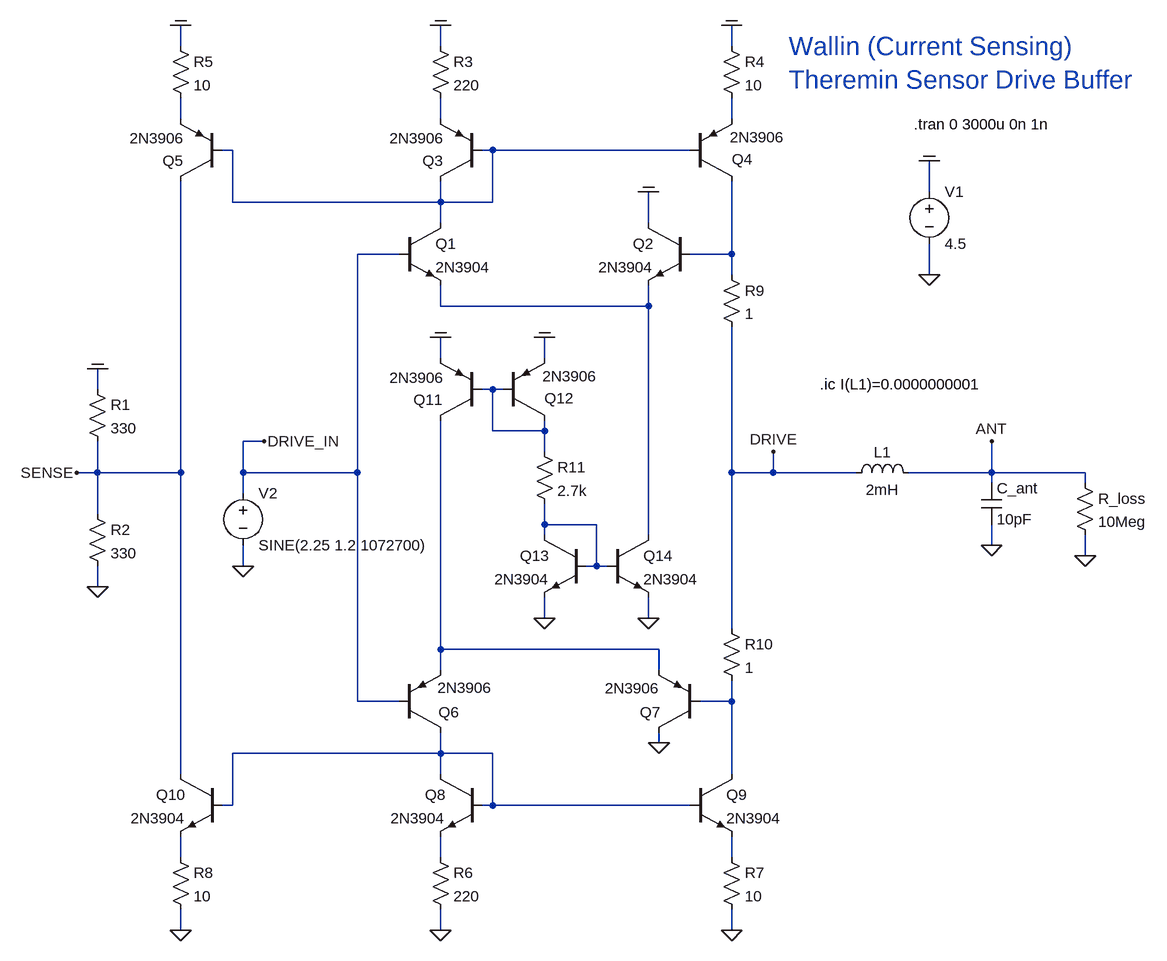
[diagram p0: schematic current_sensing_drive_buffer_v02.asc]
current_sensing_drive_buffer_v02.asc, the LTspice schematic file:
Version 4
SHEET 1 4504 6144
WIRE 864 2288 864 2256
WIRE 1264 2288 1264 2256
WIRE 1712 2288 1712 2256
WIRE 864 2400 864 2368
WIRE 1264 2400 1264 2368
WIRE 1712 2400 1712 2368
WIRE 944 2448 928 2448
WIRE 1344 2448 1328 2448
WIRE 1648 2448 1344 2448
WIRE 2016 2512 2016 2464
WIRE 944 2528 944 2448
WIRE 1264 2528 1264 2496
WIRE 1264 2528 944 2528
WIRE 1344 2528 1344 2448
WIRE 1344 2528 1264 2528
WIRE 1264 2560 1264 2528
WIRE 1584 2560 1584 2512
WIRE 1200 2608 1136 2608
WIRE 1712 2608 1712 2496
WIRE 1712 2608 1648 2608
WIRE 1712 2640 1712 2608
WIRE 2016 2640 2016 2592
WIRE 1264 2688 1264 2656
WIRE 1584 2688 1584 2656
WIRE 1584 2688 1264 2688
WIRE 1264 2768 1264 2736
WIRE 1424 2768 1424 2736
WIRE 736 2816 736 2784
WIRE 1344 2816 1328 2816
WIRE 1360 2816 1344 2816
WIRE 1344 2880 1344 2816
WIRE 1424 2880 1424 2864
WIRE 1424 2880 1344 2880
WIRE 992 2896 960 2896
WIRE 1424 2912 1424 2880
WIRE 736 2944 736 2896
WIRE 736 2944 704 2944
WIRE 864 2944 864 2496
WIRE 864 2944 736 2944
WIRE 960 2944 960 2896
WIRE 1136 2944 1136 2608
WIRE 1136 2944 960 2944
WIRE 1712 2944 1712 2720
WIRE 1776 2944 1776 2912
WIRE 1776 2944 1712 2944
WIRE 1904 2944 1776 2944
WIRE 2112 2944 2112 2896
WIRE 2112 2944 1984 2944
WIRE 2256 2944 2112 2944
WIRE 2112 2960 2112 2944
WIRE 2256 2960 2256 2944
WIRE 960 2976 960 2944
WIRE 736 3008 736 2944
WIRE 1424 3024 1424 2992
WIRE 1504 3024 1424 3024
WIRE 1424 3040 1424 3024
WIRE 1584 3040 1584 2688
WIRE 2112 3056 2112 3024
WIRE 2256 3072 2256 3040
WIRE 960 3088 960 3056
WIRE 1504 3088 1504 3024
WIRE 1504 3088 1488 3088
WIRE 1520 3088 1504 3088
WIRE 736 3120 736 3088
WIRE 1424 3168 1424 3136
WIRE 1584 3168 1584 3136
WIRE 1712 3184 1712 2944
WIRE 1264 3216 1264 2864
WIRE 1600 3216 1264 3216
WIRE 1264 3248 1264 3216
WIRE 1600 3248 1600 3216
WIRE 1136 3296 1136 2944
WIRE 1200 3296 1136 3296
WIRE 1712 3296 1712 3264
WIRE 1712 3296 1664 3296
WIRE 1600 3360 1600 3344
WIRE 1264 3376 1264 3344
WIRE 1264 3376 944 3376
WIRE 1344 3376 1264 3376
WIRE 864 3408 864 2944
WIRE 1264 3408 1264 3376
WIRE 1712 3408 1712 3296
WIRE 944 3456 944 3376
WIRE 944 3456 928 3456
WIRE 1344 3456 1344 3376
WIRE 1344 3456 1328 3456
WIRE 1648 3456 1344 3456
WIRE 864 3536 864 3504
WIRE 1264 3536 1264 3504
WIRE 1712 3536 1712 3504
WIRE 864 3648 864 3616
WIRE 1264 3648 1264 3616
WIRE 1712 3648 1712 3616
FLAG 2016 2640 0
FLAG 2016 2464 COM
FLAG 1424 3168 0
FLAG 1584 3168 0
FLAG 1264 2256 COM
FLAG 1712 2256 COM
FLAG 1584 2512 COM
FLAG 960 3088 0
FLAG 1424 2736 COM
FLAG 1264 2736 COM
FLAG 1264 3648 0
FLAG 1712 3648 0
FLAG 1600 3360 0
FLAG 864 2256 COM
FLAG 864 3648 0
FLAG 2112 3056 0
FLAG 2112 2896 ANT
FLAG 1776 2912 DRIVE
FLAG 2256 3072 0
FLAG 736 3120 0
FLAG 736 2784 COM
FLAG 704 2944 SENSE
FLAG 992 2896 DRIVE_IN
SYMBOL voltage 2016 2496 R0
SYMATTR InstName V1
SYMATTR Value 4.5
SYMBOL npn 1488 3040 M0
SYMATTR InstName Q13
SYMATTR Value 2N3904
SYMBOL npn 1520 3040 R0
SYMATTR InstName Q14
SYMATTR Value 2N3904
SYMBOL npn 1648 2560 M0
SYMATTR InstName Q2
SYMATTR Value 2N3904
SYMBOL npn 1200 2560 R0
SYMATTR InstName Q1
SYMATTR Value 2N3904
SYMBOL pnp 1328 2496 R180
WINDOW 0 60 32 Left 2
WINDOW 3 58 66 Left 2
SYMATTR InstName Q3
SYMATTR Value 2N3906
SYMBOL Res 1248 2272 R0
SYMATTR InstName R3
SYMATTR Value 220
SYMBOL pnp 1648 2496 M180
WINDOW 0 64 34 Left 2
WINDOW 3 61 68 Left 2
SYMATTR InstName Q4
SYMATTR Value 2N3906
SYMBOL Res 1696 2272 R0
SYMATTR InstName R4
SYMATTR Value 10
SYMBOL Voltage 960 2960 R0
SYMATTR InstName V2
SYMATTR Value SINE(2.25 1.2 1072700)
SYMBOL pnp 1328 2864 R180
WINDOW 0 60 32 Left 2
WINDOW 3 58 66 Left 2
SYMATTR InstName Q11
SYMATTR Value 2N3906
SYMBOL pnp 1360 2864 M180
WINDOW 0 64 34 Left 2
WINDOW 3 61 68 Left 2
SYMATTR InstName Q12
SYMATTR Value 2N3906
SYMBOL npn 1328 3408 M0
SYMATTR InstName Q8
SYMATTR Value 2N3904
SYMBOL npn 1648 3408 R0
SYMATTR InstName Q9
SYMATTR Value 2N3904
SYMBOL Res 1248 3520 R0
SYMATTR InstName R6
SYMATTR Value 220
SYMBOL Res 1696 3520 R0
SYMATTR InstName R7
SYMATTR Value 10
SYMBOL pnp 1664 3344 R180
WINDOW 0 61 31 Left 2
WINDOW 3 62 68 Left 2
SYMATTR InstName Q7
SYMATTR Value 2N3906
SYMBOL pnp 1200 3344 M180
WINDOW 0 61 31 Left 2
WINDOW 3 59 69 Left 2
SYMATTR InstName Q6
SYMATTR Value 2N3906
SYMBOL Res 1696 3168 R0
SYMATTR InstName R10
SYMATTR Value 1
SYMBOL Res 1696 2624 R0
SYMATTR InstName R9
SYMATTR Value 1
SYMBOL pnp 928 2496 R180
WINDOW 0 60 32 Left 2
WINDOW 3 58 66 Left 2
SYMATTR InstName Q5
SYMATTR Value 2N3906
SYMBOL Res 848 2272 R0
SYMATTR InstName R5
SYMATTR Value 10
SYMBOL npn 928 3408 M0
SYMATTR InstName Q10
SYMATTR Value 2N3904
SYMBOL Res 848 3520 R0
SYMATTR InstName R8
SYMATTR Value 10
SYMBOL ind 1888 2960 R270
WINDOW 0 32 56 VTop 2
WINDOW 3 5 56 VBottom 2
SYMATTR InstName L1
SYMATTR Value 2mH
SYMATTR SpiceLine Rser=120 Cpar=1pF
SYMBOL Cap 2096 2960 R0
SYMATTR InstName C_ant
SYMATTR Value 10pF
SYMBOL Res 2240 2944 R0
SYMATTR InstName R_loss
SYMATTR Value 10Meg
SYMBOL Res 720 2992 R0
SYMATTR InstName R2
SYMATTR Value 330
SYMBOL Res 720 2800 R0
SYMATTR InstName R1
SYMATTR Value 330
SYMBOL Res 1408 2896 R0
SYMATTR InstName R11
SYMATTR Value 2.7k
TEXT 1992 2408 Left 2 !.tran 0 3000u 0n 1n
TEXT 1848 2808 Left 2 !.ic I(L1)=0.0000000001
TEXT 1800 2288 Left 4 ;Wallin (Current Sensing) \nTheremin Sensor Drive Buffer

The netlist it stands for:
* current_sensing_drive_buffer_v02.asc
V1 COM 0 4.5
Q13 N008 N008 0 0 2N3904
Q14 N006 N008 0 0 2N3904
Q2 COM N005 N006 0 2N3904
Q1 N004 DRIVE_IN N006 0 2N3904
Q3 N004 N004 N002 0 2N3906
R3 COM N002 220
Q4 N005 N004 N003 0 2N3906
R4 COM N003 10
V2 DRIVE_IN 0 SINE(2.25 1.2 1072700)
Q11 N009 N007 COM 0 2N3906
Q12 N007 N007 COM 0 2N3906
Q8 N011 N011 N013 0 2N3904
Q9 N010 N011 N014 0 2N3904
R6 N013 0 220
R7 N014 0 10
Q7 0 N010 N009 0 2N3906
Q6 N011 DRIVE_IN N009 0 2N3906
R10 DRIVE N010 1
R9 N005 DRIVE 1
Q5 SENSE N004 N001 0 2N3906
R5 COM N001 10
Q10 SENSE N011 N012 0 2N3904
R8 N012 0 10
L1 DRIVE ANT 2mH Rser=120 Cpar=1pF
C_ant ANT 0 10pF
R_loss ANT 0 10Meg
R2 SENSE 0 330
R1 COM SENSE 330
R11 N007 N008 2.7k
.model NPN NPN
.model PNP PNP
.lib standard.bjt
.tran 0 3000u 0n 1n
.ic I(L1)=0.0000000001
* Wallin (Current Sensing)
* Theremin Sensor Drive Buffer
.backanno
.end